# Altium schematic sheet 10X SD CARD READER SCH SHEET 3.SchDoc
size A2
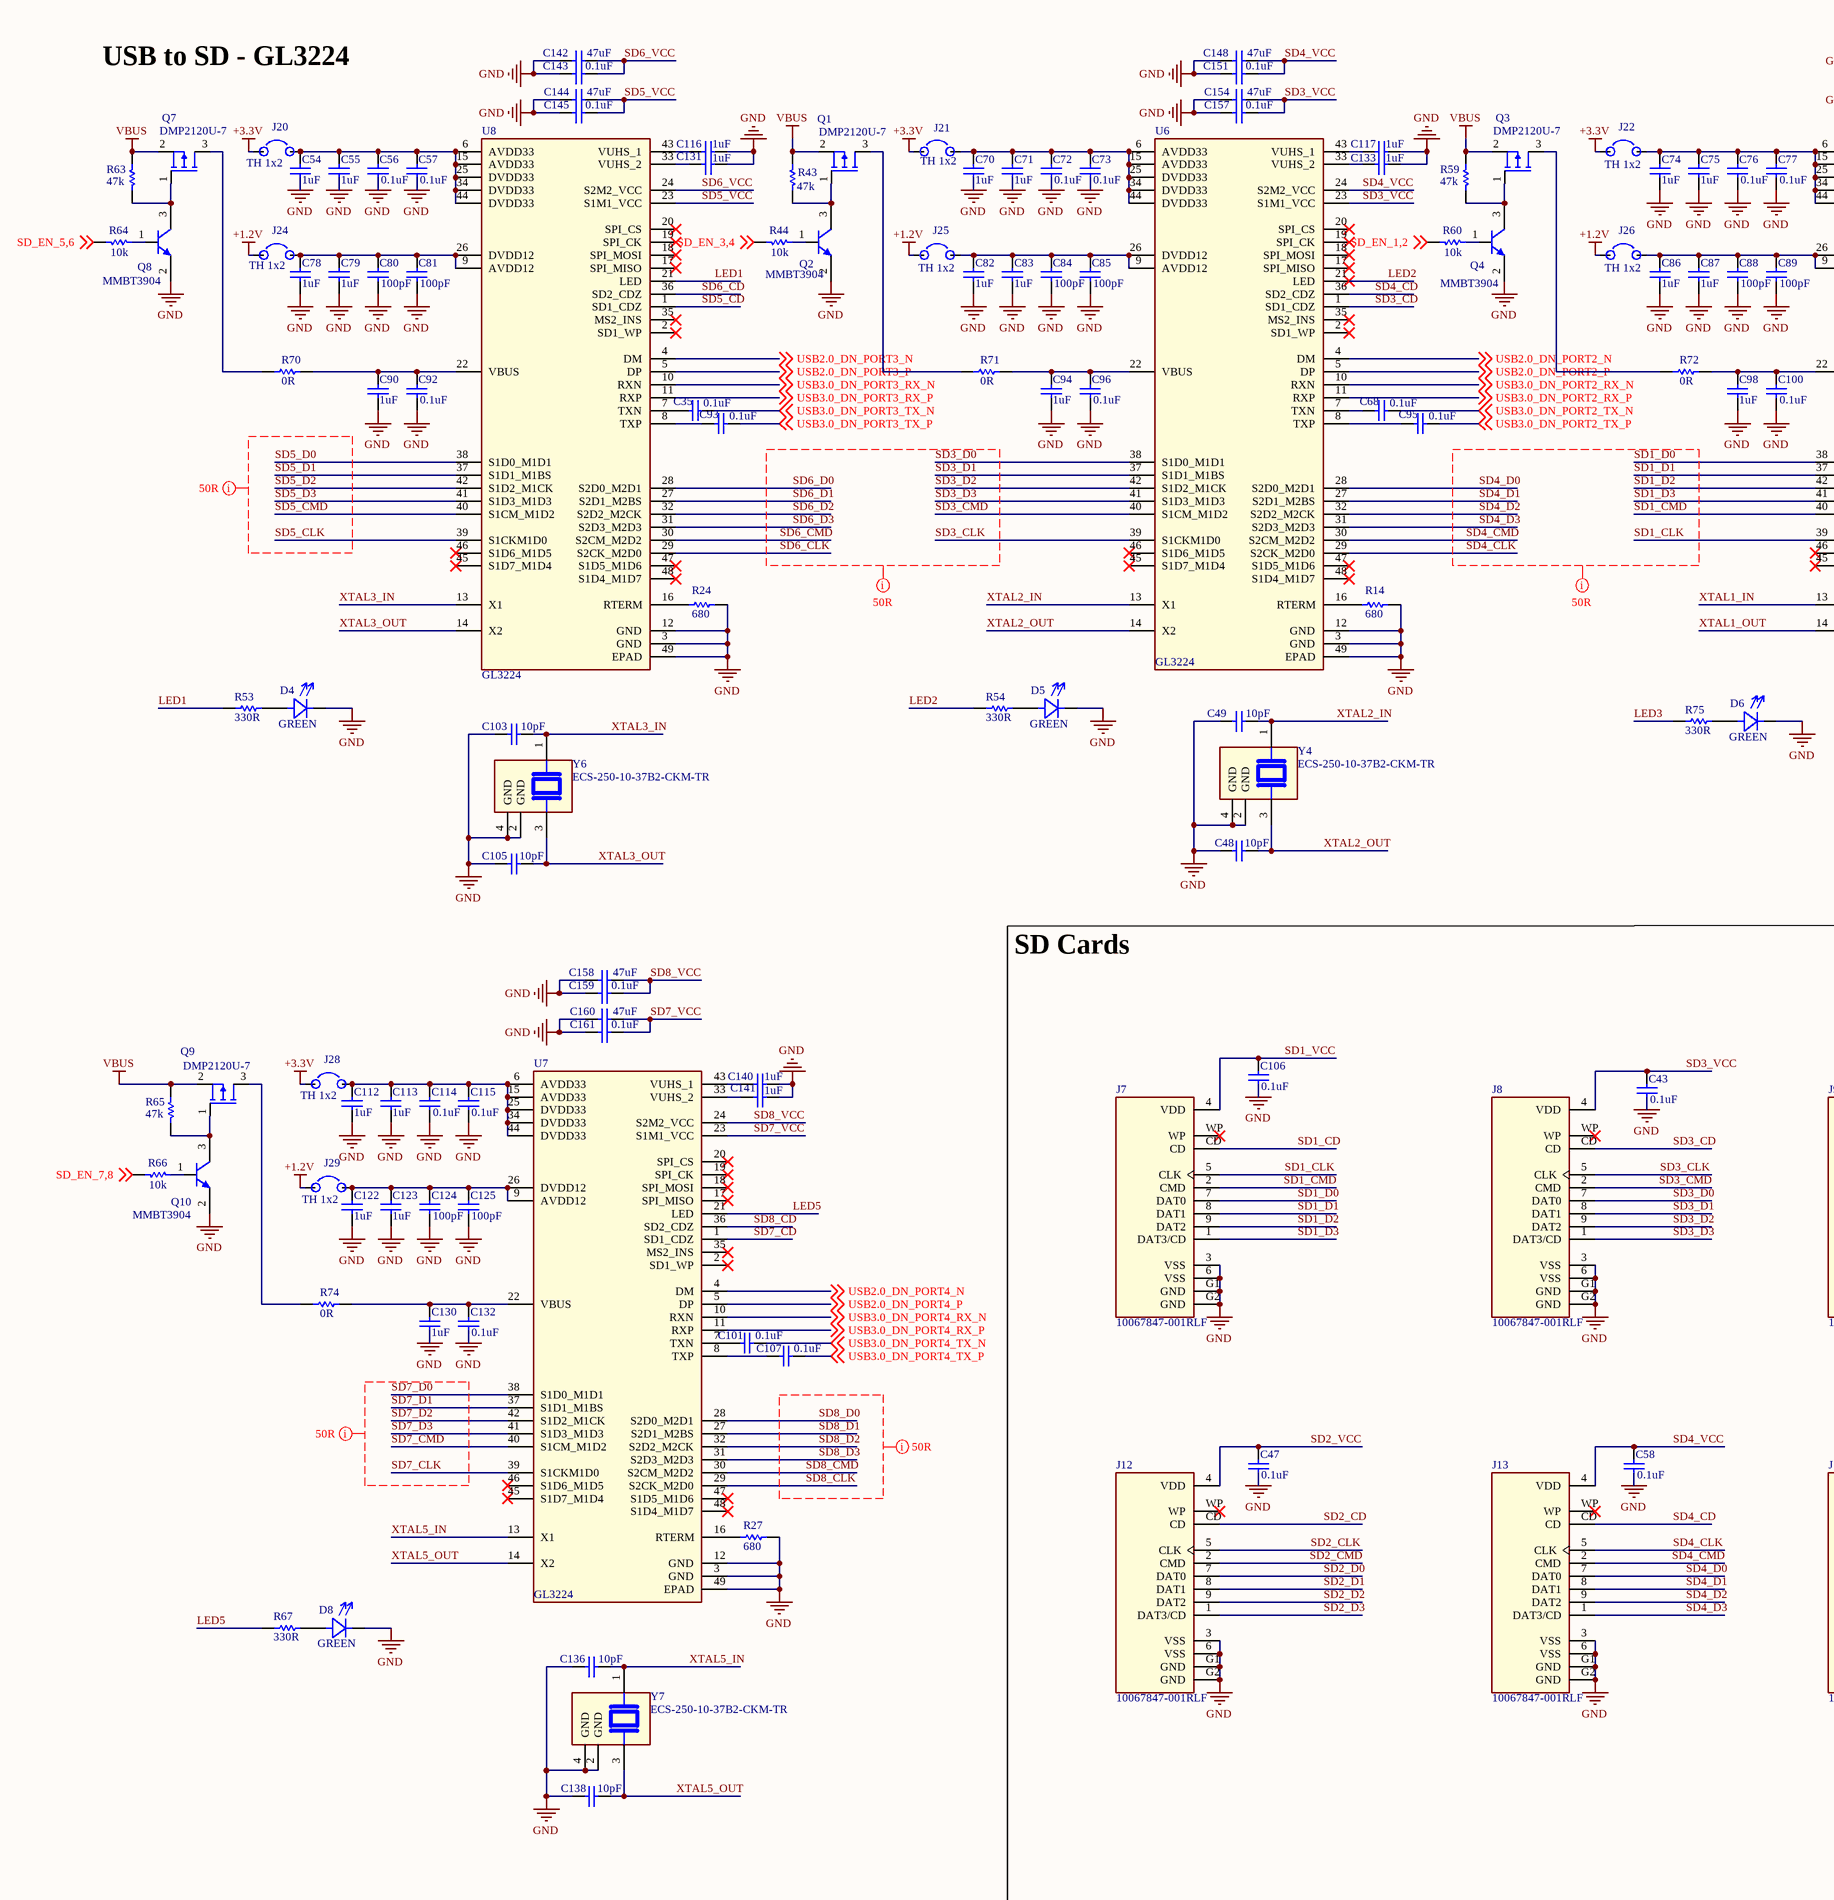
[diagram p0: 10X SD CARD READER SCH SHEET 3.SchDoc, left]
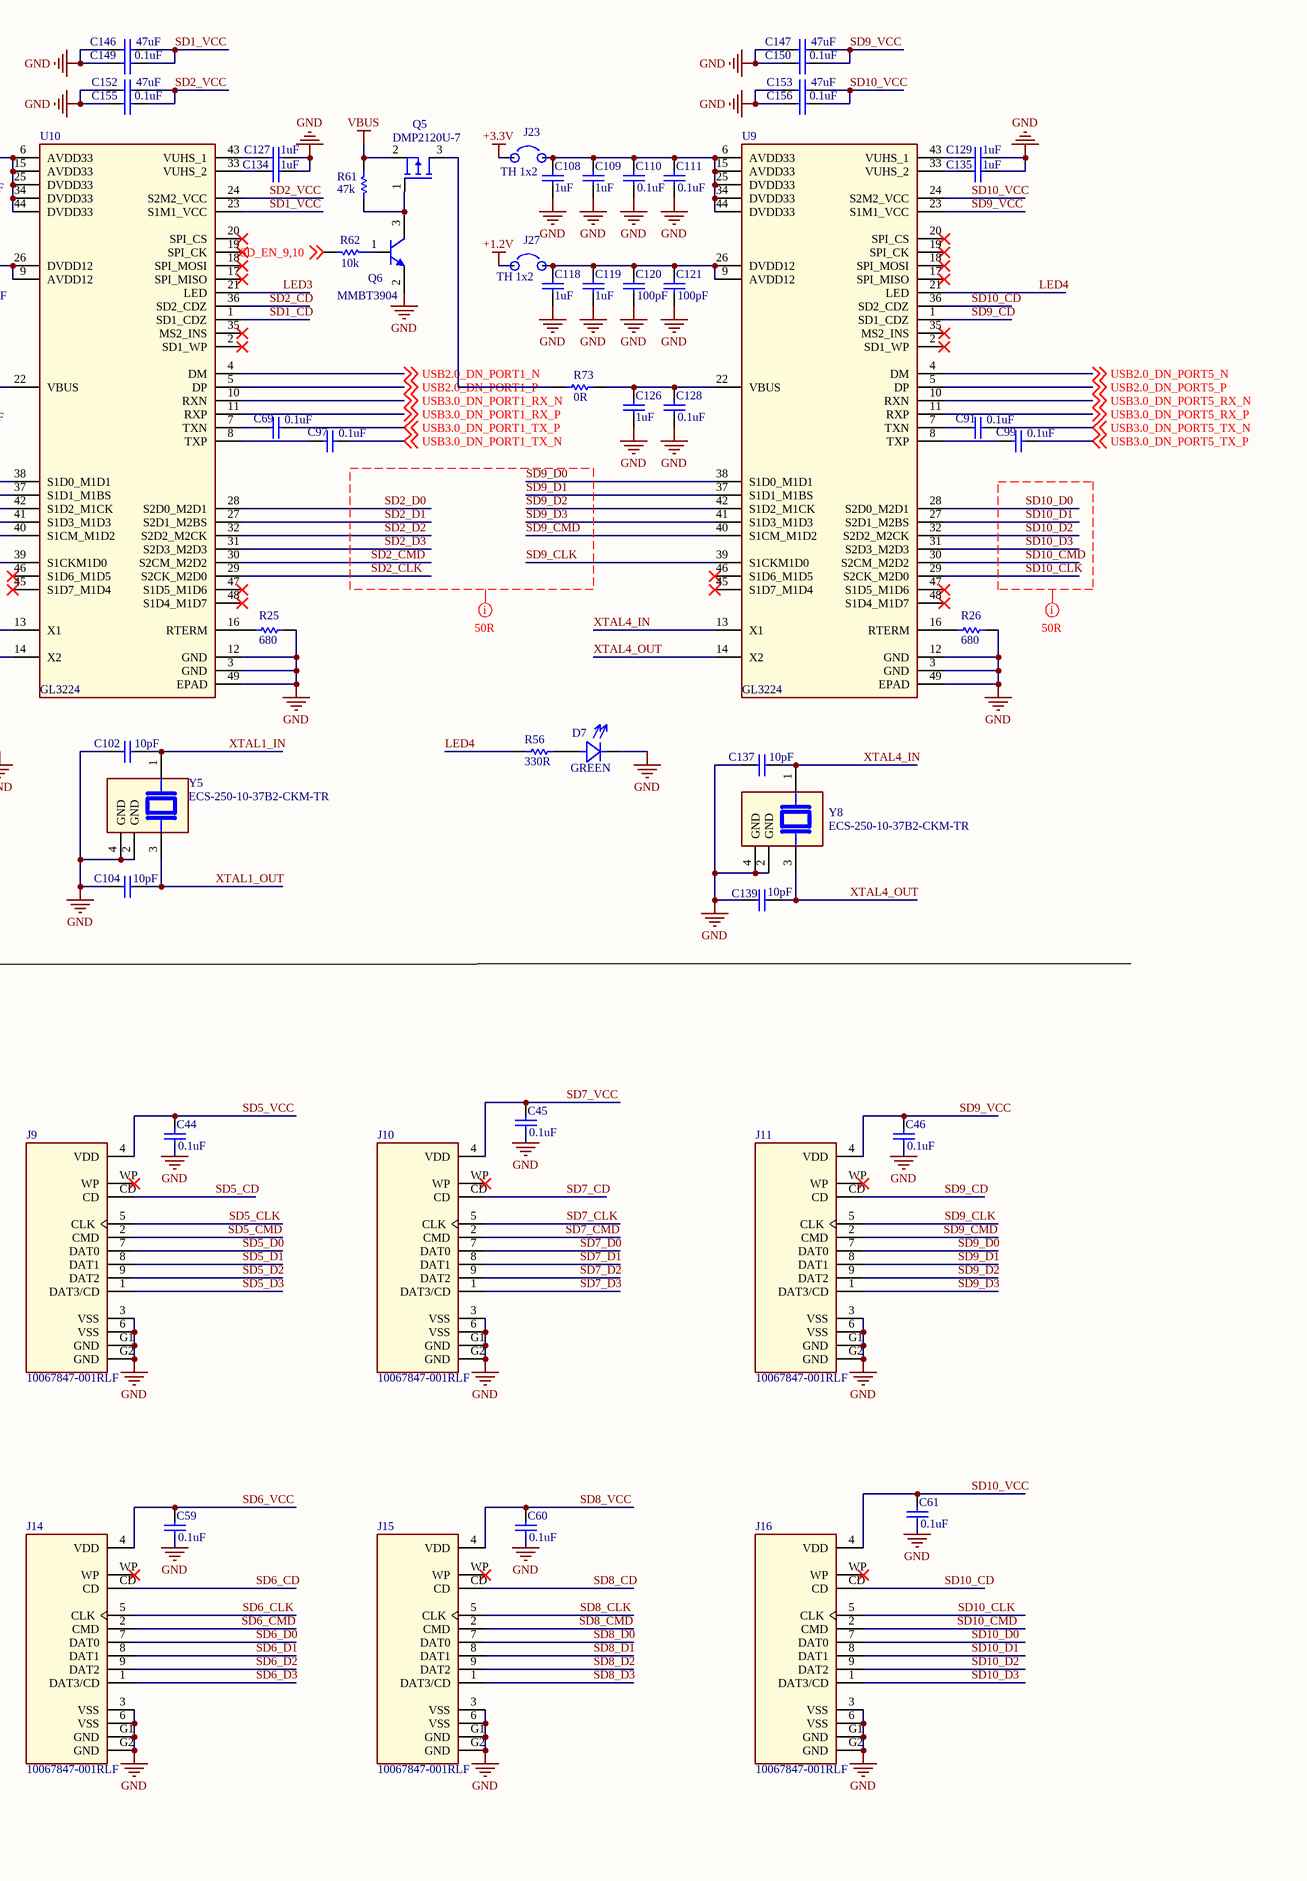
[diagram p1: 10X SD CARD READER SCH SHEET 3.SchDoc, right]

## Parts
C35  0.1uF  [C-0402/1005]
C43  0.1uF  [C-0402/1005]
C44  0.1uF  [C-0402/1005]
C45  0.1uF  [C-0402/1005]
C46  0.1uF  [C-0402/1005]
C47  0.1uF  [C-0402/1005]
C48  10pF  [C-0402/1005]
C49  10pF  [C-0402/1005]
C54  1uF  [C-0402/1005]
C55  1uF  [C-0402/1005]
C56  0.1uF  [C-0402/1005]
C57  0.1uF  [C-0402/1005]
C58  0.1uF  [C-0402/1005]
C59  0.1uF  [C-0402/1005]
C60  0.1uF  [C-0402/1005]
C61  0.1uF  [C-0402/1005]
C68  0.1uF  [C-0402/1005]
C69  0.1uF  [C-0402/1005]
C70  1uF  [C-0402/1005]
C71  1uF  [C-0402/1005]
C72  0.1uF  [C-0402/1005]
C73  0.1uF  [C-0402/1005]
C74  1uF  [C-0402/1005]
C75  1uF  [C-0402/1005]
C76  0.1uF  [C-0402/1005]
C77  0.1uF  [C-0402/1005]
C78  1uF  [C-0402/1005]
C79  1uF  [C-0402/1005]
C80  value 100pF  [C-0402/1005]  (hidden comment: 0.1uF)
C81  value 100pF  [C-0402/1005]  (hidden comment: 0.1uF)
C82  1uF  [C-0402/1005]
C83  1uF  [C-0402/1005]
C84  value 100pF  [C-0402/1005]  (hidden comment: 0.1uF)
C85  value 100pF  [C-0402/1005]  (hidden comment: 0.1uF)
C86  1uF  [C-0402/1005]
C87  1uF  [C-0402/1005]
C88  value 100pF  [C-0402/1005]  (hidden comment: 0.1uF)
C89  value 100pF  [C-0402/1005]  (hidden comment: 0.1uF)
C90  1uF  [C-0402/1005]
C91  0.1uF  [C-0402/1005]
C92  0.1uF  [C-0402/1005]
C93  0.1uF  [C-0402/1005]
C94  1uF  [C-0402/1005]
C95  0.1uF  [C-0402/1005]
C96  0.1uF  [C-0402/1005]
C97  0.1uF  [C-0402/1005]
C98  1uF  [C-0402/1005]
C99  0.1uF  [C-0402/1005]
C100  0.1uF  [C-0402/1005]
C101  0.1uF  [C-0402/1005]
C102  10pF  [C-0402/1005]
C103  10pF  [C-0402/1005]
C104  10pF  [C-0402/1005]
C105  10pF  [C-0402/1005]
C106  0.1uF  [C-0402/1005]
C107  0.1uF  [C-0402/1005]
C108  1uF  [C-0402/1005]
C109  1uF  [C-0402/1005]
C110  0.1uF  [C-0402/1005]
C111  0.1uF  [C-0402/1005]
C112  1uF  [C-0402/1005]
C113  1uF  [C-0402/1005]
C114  0.1uF  [C-0402/1005]
C115  0.1uF  [C-0402/1005]
C116  1uF  [C-0402/1005]
C117  1uF  [C-0402/1005]
C118  1uF  [C-0402/1005]
C119  1uF  [C-0402/1005]
C120  value 100pF  [C-0402/1005]  (hidden comment: 0.1uF)
C121  value 100pF  [C-0402/1005]  (hidden comment: 0.1uF)
C122  1uF  [C-0402/1005]
C123  1uF  [C-0402/1005]
C124  value 100pF  [C-0402/1005]  (hidden comment: 0.1uF)
C125  value 100pF  [C-0402/1005]  (hidden comment: 0.1uF)
C126  1uF  [C-0402/1005]
C127  1uF  [C-0402/1005]
C128  0.1uF  [C-0402/1005]
C129  1uF  [C-0402/1005]
C130  1uF  [C-0402/1005]
C131  1uF  [C-0402/1005]
C132  0.1uF  [C-0402/1005]
C133  1uF  [C-0402/1005]
C134  1uF  [C-0402/1005]
C135  1uF  [C-0402/1005]
C136  10pF  [C-0402/1005]
C137  10pF  [C-0402/1005]
C138  10pF  [C-0402/1005]
C139  10pF  [C-0402/1005]
C140  1uF  [C-0402/1005]
C141  1uF  [C-0402/1005]
C142  value 47uF  [C-0603/1608]  (hidden comment: 0.1uF)
C143  0.1uF  [C-0402/1005]
C144  value 47uF  [C-0603/1608]  (hidden comment: 0.1uF)
C145  0.1uF  [C-0402/1005]
C146  value 47uF  [C-0603/1608]  (hidden comment: 0.1uF)
C147  value 47uF  [C-0603/1608]  (hidden comment: 0.1uF)
C148  value 47uF  [C-0603/1608]  (hidden comment: 0.1uF)
C149  0.1uF  [C-0402/1005]
C150  0.1uF  [C-0402/1005]
C151  0.1uF  [C-0402/1005]
C152  value 47uF  [C-0603/1608]  (hidden comment: 0.1uF)
C153  value 47uF  [C-0603/1608]  (hidden comment: 0.1uF)
C154  value 47uF  [C-0603/1608]  (hidden comment: 0.1uF)
C155  0.1uF  [C-0402/1005]
C156  0.1uF  [C-0402/1005]
C157  0.1uF  [C-0402/1005]
C158  value 47uF  [C-0603/1608]  (hidden comment: 0.1uF)
C159  0.1uF  [C-0402/1005]
C160  value 47uF  [C-0603/1608]  (hidden comment: 0.1uF)
C161  0.1uF  [C-0402/1005]
D4  GREEN  [LEDC1608X65N]
D5  GREEN  [LEDC1608X65N]
D6  GREEN  [LEDC1608X65N]
D7  GREEN  [LEDC1608X65N]
D8  GREEN  [LEDC1608X65N]
J7  10067847-001RLF  [AMPHENOL_10067847-011RLF]
J8  10067847-001RLF  [AMPHENOL_10067847-011RLF]
J9  10067847-001RLF  [AMPHENOL_10067847-011RLF]
J10  10067847-001RLF  [AMPHENOL_10067847-011RLF]
J11  10067847-001RLF  [AMPHENOL_10067847-011RLF]
J12  10067847-001RLF  [AMPHENOL_10067847-011RLF]
J13  10067847-001RLF  [AMPHENOL_10067847-011RLF]
J14  10067847-001RLF  [AMPHENOL_10067847-011RLF]
J15  10067847-001RLF  [AMPHENOL_10067847-011RLF]
J16  10067847-001RLF  [AMPHENOL_10067847-011RLF]
J20  TH 1x2  [PIN HEADER 1x2 2.54mm]
J21  TH 1x2  [PIN HEADER 1x2 2.54mm]
J22  TH 1x2  [PIN HEADER 1x2 2.54mm]
J23  TH 1x2  [PIN HEADER 1x2 2.54mm]
J24  TH 1x2  [PIN HEADER 1x2 2.54mm]
J25  TH 1x2  [PIN HEADER 1x2 2.54mm]
J26  TH 1x2  [PIN HEADER 1x2 2.54mm]
J27  TH 1x2  [PIN HEADER 1x2 2.54mm]
J28  TH 1x2  [PIN HEADER 1x2 2.54mm]
J29  TH 1x2  [PIN HEADER 1x2 2.54mm]
Q1  DMP2120U-7  [SOT-23-3]
Q2  MMBT3904  [SOT-23-3]
Q3  DMP2120U-7  [SOT-23-3]
Q4  MMBT3904  [SOT-23-3]
Q5  DMP2120U-7  [SOT-23-3]
Q6  MMBT3904  [SOT-23-3]
Q7  DMP2120U-7  [SOT-23-3]
Q8  MMBT3904  [SOT-23-3]
Q9  DMP2120U-7  [SOT-23-3]
Q10  MMBT3904  [SOT-23-3]
R14  680  [R-0402/1005]
R24  680  [R-0402/1005]
R25  680  [R-0402/1005]
R26  680  [R-0402/1005]
R27  680  [R-0402/1005]
R43  47k  [R-0402/1005]
R44  10k  [R-0402/1005]
R53  330R  [R-0402/1005]
R54  330R  [R-0402/1005]
R56  330R  [R-0402/1005]
R59  47k  [R-0402/1005]
R60  10k  [R-0402/1005]
R61  47k  [R-0402/1005]
R62  10k  [R-0402/1005]
R63  47k  [R-0402/1005]
R64  10k  [R-0402/1005]
R65  47k  [R-0402/1005]
R66  10k  [R-0402/1005]
R67  330R  [R-0402/1005]
R70  0R  [R-0603/1608]
R71  0R  [R-0603/1608]
R72  0R  [R-0603/1608]
R73  0R  [R-0603/1608]
R74  0R  [R-0603/1608]
R75  330R  [R-0402/1005]
U6  GL3224  [GL3224]
U7  GL3224  [GL3224]
U8  GL3224  [GL3224]
U9  GL3224  [GL3224]
U10  GL3224  [GL3224]
Y4  ECS-250-10-37B2-CKM-TR  [ECS-250-10-37B2]
Y5  ECS-250-10-37B2-CKM-TR  [ECS-250-10-37B2]
Y6  ECS-250-10-37B2-CKM-TR  [ECS-250-10-37B2]
Y7  ECS-250-10-37B2-CKM-TR  [ECS-250-10-37B2]
Y8  ECS-250-10-37B2-CKM-TR  [ECS-250-10-37B2]

## Nets
+1.2V: J24.1 J25.1 J26.1 J27.1 J29.1
+3.3V: J20.1 J21.1 J22.1 J23.1 J28.1
GND: C43.1 C44.1 C45.1 C46.1 C47.1 C48.2 C49.2 C54.1 C55.1 C56.1 C57.1 C58.1 C59.1 C60.1 C61.1 C70.1 C71.1 C72.1 C73.1 C74.1 C75.1 C76.1 C77.1 C78.1 C79.1 C80.1 C81.1 C82.1 C83.1 C84.1 C85.1 C86.1 C87.1 C88.1 C89.1 C90.1 C92.1 C94.1 C96.1 C98.1 C100.1 C102.2 C103.2 C104.2 C105.2 C106.1 C108.1 C109.1 C110.1 C111.1 C112.1 C113.1 C114.1 C115.1 C116.1 C117.1 C118.1 C119.1 C120.1 C121.1 C122.1 C123.1 C124.1 C125.1 C126.1 C127.1 C128.1 C129.1 C130.1 C131.1 C132.1 C133.1 C134.1 C135.1 C136.2 C137.2 C138.2 C139.2 C140.1 C141.1 C142.1 C143.1 C144.1 C145.1 C146.1 C147.1 C148.1 C149.1 C150.1 C151.1 C152.1 C153.1 C154.1 C155.1 C156.1 C157.1 C158.1 C159.1 C160.1 C161.1 D4.C D5.C D6.C D7.C D8.C J7.3(VSS) J7.6(VSS) J7.G1(GND) J7.G2(GND) J8.3(VSS) J8.6(VSS) J8.G1(GND) J8.G2(GND) J9.3(VSS) J9.6(VSS) J9.G1(GND) J9.G2(GND) J10.3(VSS) J10.6(VSS) J10.G1(GND) J10.G2(GND) J11.3(VSS) J11.6(VSS) J11.G1(GND) J11.G2(GND) J12.3(VSS) J12.6(VSS) J12.G1(GND) J12.G2(GND) J13.3(VSS) J13.6(VSS) J13.G1(GND) J13.G2(GND) J14.3(VSS) J14.6(VSS) J14.G1(GND) J14.G2(GND) J15.3(VSS) J15.6(VSS) J15.G1(GND) J15.G2(GND) J16.3(VSS) J16.6(VSS) J16.G1(GND) J16.G2(GND) Q2.2(E) Q4.2(E) Q6.2(E) Q8.2(E) Q10.2(E) R14.1 R24.1 R25.1 R26.1 R27.1 U6.3(GND) U6.12(GND) U6.49(EPAD) U7.3(GND) U7.12(GND) U7.49(EPAD) U8.3(GND) U8.12(GND) U8.49(EPAD) U9.3(GND) U9.12(GND) U9.49(EPAD) U10.3(GND) U10.12(GND) U10.49(EPAD) Y4.2(GND) Y4.4(GND) Y5.2(GND) Y5.4(GND) Y6.2(GND) Y6.4(GND) Y7.2(GND) Y7.4(GND) Y8.2(GND) Y8.4(GND)
VBUS: Q1.2 Q3.2 Q5.2 Q7.2 Q9.2 R43.1 R59.1 R61.1 R63.1 R65.1
LED1: R53.2 U8.21(LED)
LED2: R54.2 U6.21(LED)
LED3: R75.2 U10.21(LED)
LED4: R56.2 U9.21(LED)
LED5: R67.2 U7.21(LED)
SD1_CD: J7.CD U10.1(SD1_CDZ)
SD1_CLK: J7.5(CLK) U10.39(S1CKM1D0)
SD1_CMD: J7.2(CMD) U10.40(S1CM_M1D2)
SD1_D0: J7.7(DAT0) U10.38(S1D0_M1D1)
SD1_D1: J7.8(DAT1) U10.37(S1D1_M1BS)
SD1_D2: J7.9(DAT2) U10.42(S1D2_M1CK)
SD1_D3: J7.1(DAT3/CD) U10.41(S1D3_M1D3)
SD1_VCC: C106.2 C146.2 C149.2 J7.4(VDD) U10.23(S1M1_VCC)
SD2_CD: J12.CD U10.36(SD2_CDZ)
SD2_CLK: J12.5(CLK) U10.29(S2CK_M2D0)
SD2_CMD: J12.2(CMD) U10.30(S2CM_M2D2)
SD2_D0: J12.7(DAT0) U10.28(S2D0_M2D1)
SD2_D1: J12.8(DAT1) U10.27(S2D1_M2BS)
SD2_D2: J12.9(DAT2) U10.32(S2D2_M2CK)
SD2_D3: J12.1(DAT3/CD) U10.31(S2D3_M2D3)
SD2_VCC: C47.2 C152.2 C155.2 J12.4(VDD) U10.24(S2M2_VCC)
SD3_CD: J8.CD U6.1(SD1_CDZ)
SD3_CLK: J8.5(CLK) U6.39(S1CKM1D0)
SD3_CMD: J8.2(CMD) U6.40(S1CM_M1D2)
SD3_D0: J8.7(DAT0) U6.38(S1D0_M1D1)
SD3_D1: J8.8(DAT1) U6.37(S1D1_M1BS)
SD3_D2: J8.9(DAT2) U6.42(S1D2_M1CK)
SD3_D3: J8.1(DAT3/CD) U6.41(S1D3_M1D3)
SD3_VCC: C43.2 C154.2 C157.2 J8.4(VDD) U6.23(S1M1_VCC)
SD4_CD: J13.CD U6.36(SD2_CDZ)
SD4_CLK: J13.5(CLK) U6.29(S2CK_M2D0)
SD4_CMD: J13.2(CMD) U6.30(S2CM_M2D2)
SD4_D0: J13.7(DAT0) U6.28(S2D0_M2D1)
SD4_D1: J13.8(DAT1) U6.27(S2D1_M2BS)
SD4_D2: J13.9(DAT2) U6.32(S2D2_M2CK)
SD4_D3: J13.1(DAT3/CD) U6.31(S2D3_M2D3)
SD4_VCC: C58.2 C148.2 C151.2 J13.4(VDD) U6.24(S2M2_VCC)
SD5_CD: J9.CD U8.1(SD1_CDZ)
SD5_CLK: J9.5(CLK) U8.39(S1CKM1D0)
SD5_CMD: J9.2(CMD) U8.40(S1CM_M1D2)
SD5_D0: J9.7(DAT0) U8.38(S1D0_M1D1)
SD5_D1: J9.8(DAT1) U8.37(S1D1_M1BS)
SD5_D2: J9.9(DAT2) U8.42(S1D2_M1CK)
SD5_D3: J9.1(DAT3/CD) U8.41(S1D3_M1D3)
SD5_VCC: C44.2 C144.2 C145.2 J9.4(VDD) U8.23(S1M1_VCC)
SD6_CD: J14.CD U8.36(SD2_CDZ)
SD6_CLK: J14.5(CLK) U8.29(S2CK_M2D0)
SD6_CMD: J14.2(CMD) U8.30(S2CM_M2D2)
SD6_D0: J14.7(DAT0) U8.28(S2D0_M2D1)
SD6_D1: J14.8(DAT1) U8.27(S2D1_M2BS)
SD6_D2: J14.9(DAT2) U8.32(S2D2_M2CK)
SD6_D3: J14.1(DAT3/CD) U8.31(S2D3_M2D3)
SD6_VCC: C59.2 C142.2 C143.2 J14.4(VDD) U8.24(S2M2_VCC)
SD7_CD: J10.CD U7.1(SD1_CDZ)
SD7_CLK: J10.5(CLK) U7.39(S1CKM1D0)
SD7_CMD: J10.2(CMD) U7.40(S1CM_M1D2)
SD7_D0: J10.7(DAT0) U7.38(S1D0_M1D1)
SD7_D1: J10.8(DAT1) U7.37(S1D1_M1BS)
SD7_D2: J10.9(DAT2) U7.42(S1D2_M1CK)
SD7_D3: J10.1(DAT3/CD) U7.41(S1D3_M1D3)
SD7_VCC: C45.2 C160.2 C161.2 J10.4(VDD) U7.23(S1M1_VCC)
SD8_CD: J15.CD U7.36(SD2_CDZ)
SD8_CLK: J15.5(CLK) U7.29(S2CK_M2D0)
SD8_CMD: J15.2(CMD) U7.30(S2CM_M2D2)
SD8_D0: J15.7(DAT0) U7.28(S2D0_M2D1)
SD8_D1: J15.8(DAT1) U7.27(S2D1_M2BS)
SD8_D2: J15.9(DAT2) U7.32(S2D2_M2CK)
SD8_D3: J15.1(DAT3/CD) U7.31(S2D3_M2D3)
SD8_VCC: C60.2 C158.2 C159.2 J15.4(VDD) U7.24(S2M2_VCC)
SD9_CD: J11.CD U9.1(SD1_CDZ)
SD9_CLK: J11.5(CLK) U9.39(S1CKM1D0)
SD9_CMD: J11.2(CMD) U9.40(S1CM_M1D2)
SD9_D0: J11.7(DAT0) U9.38(S1D0_M1D1)
SD9_D1: J11.8(DAT1) U9.37(S1D1_M1BS)
SD9_D2: J11.9(DAT2) U9.42(S1D2_M1CK)
SD9_D3: J11.1(DAT3/CD) U9.41(S1D3_M1D3)
SD9_VCC: C46.2 C147.2 C150.2 J11.4(VDD) U9.23(S1M1_VCC)
SD10_CD: J16.CD U9.36(SD2_CDZ)
SD10_CLK: J16.5(CLK) U9.29(S2CK_M2D0)
SD10_CMD: J16.2(CMD) U9.30(S2CM_M2D2)
SD10_D0: J16.7(DAT0) U9.28(S2D0_M2D1)
SD10_D1: J16.8(DAT1) U9.27(S2D1_M2BS)
SD10_D2: J16.9(DAT2) U9.32(S2D2_M2CK)
SD10_D3: J16.1(DAT3/CD) U9.31(S2D3_M2D3)
SD10_VCC: C61.2 C153.2 C156.2 J16.4(VDD) U9.24(S2M2_VCC)
SD_EN_1,2: R60.1 ; off-sheet SD_EN_1,2
SD_EN_3,4: R44.1 ; off-sheet SD_EN_3,4
SD_EN_5,6: R64.1 ; off-sheet SD_EN_5,6
SD_EN_7,8: R66.1 ; off-sheet SD_EN_7,8
SD_EN_9,10: R62.1 ; off-sheet SD_EN_9,10
USB2.0_DN_PORT1_N: U10.4(DM) ; off-sheet USB2.0_DN_PORT1_N
USB2.0_DN_PORT1_P: U10.5(DP) ; off-sheet USB2.0_DN_PORT1_P
USB2.0_DN_PORT2_N: U6.4(DM) ; off-sheet USB2.0_DN_PORT2_N
USB2.0_DN_PORT2_P: U6.5(DP) ; off-sheet USB2.0_DN_PORT2_P
USB2.0_DN_PORT3_N: U8.4(DM) ; off-sheet USB2.0_DN_PORT3_N
USB2.0_DN_PORT3_P: U8.5(DP) ; off-sheet USB2.0_DN_PORT3_P
USB2.0_DN_PORT4_N: U7.4(DM) ; off-sheet USB2.0_DN_PORT4_N
USB2.0_DN_PORT4_P: U7.5(DP) ; off-sheet USB2.0_DN_PORT4_P
USB2.0_DN_PORT5_N: U9.4(DM) ; off-sheet USB2.0_DN_PORT5_N
USB2.0_DN_PORT5_P: U9.5(DP) ; off-sheet USB2.0_DN_PORT5_P
USB3.0_DN_PORT1_RX_N: U10.10(RXN) ; off-sheet USB3.0_DN_PORT1_RX_N
USB3.0_DN_PORT1_RX_P: U10.11(RXP) ; off-sheet USB3.0_DN_PORT1_RX_P
USB3.0_DN_PORT1_TX_N: C97.1 ; off-sheet USB3.0_DN_PORT1_TX_N
USB3.0_DN_PORT1_TX_P: C69.1 ; off-sheet USB3.0_DN_PORT1_TX_P
USB3.0_DN_PORT2_RX_N: U6.10(RXN) ; off-sheet USB3.0_DN_PORT2_RX_N
USB3.0_DN_PORT2_RX_P: U6.11(RXP) ; off-sheet USB3.0_DN_PORT2_RX_P
USB3.0_DN_PORT2_TX_N: C68.1 ; off-sheet USB3.0_DN_PORT2_TX_N
USB3.0_DN_PORT2_TX_P: C95.1 ; off-sheet USB3.0_DN_PORT2_TX_P
USB3.0_DN_PORT3_RX_N: U8.10(RXN) ; off-sheet USB3.0_DN_PORT3_RX_N
USB3.0_DN_PORT3_RX_P: U8.11(RXP) ; off-sheet USB3.0_DN_PORT3_RX_P
USB3.0_DN_PORT3_TX_N: C35.1 ; off-sheet USB3.0_DN_PORT3_TX_N
USB3.0_DN_PORT3_TX_P: C93.1 ; off-sheet USB3.0_DN_PORT3_TX_P
USB3.0_DN_PORT4_RX_N: U7.10(RXN) ; off-sheet USB3.0_DN_PORT4_RX_N
USB3.0_DN_PORT4_RX_P: U7.11(RXP) ; off-sheet USB3.0_DN_PORT4_RX_P
USB3.0_DN_PORT4_TX_N: C101.1 ; off-sheet USB3.0_DN_PORT4_TX_N
USB3.0_DN_PORT4_TX_P: C107.1 ; off-sheet USB3.0_DN_PORT4_TX_P
USB3.0_DN_PORT5_RX_N: U9.10(RXN) ; off-sheet USB3.0_DN_PORT5_RX_N
USB3.0_DN_PORT5_RX_P: U9.11(RXP) ; off-sheet USB3.0_DN_PORT5_RX_P
USB3.0_DN_PORT5_TX_N: C91.1 ; off-sheet USB3.0_DN_PORT5_TX_N
USB3.0_DN_PORT5_TX_P: C99.1 ; off-sheet USB3.0_DN_PORT5_TX_P
XTAL1_IN: C102.1 U10.13(X1) Y5.1
XTAL1_OUT: C104.1 U10.14(X2) Y5.3
XTAL2_IN: C49.1 U6.13(X1) Y4.1
XTAL2_OUT: C48.1 U6.14(X2) Y4.3
XTAL3_IN: C103.1 U8.13(X1) Y6.1
XTAL3_OUT: C105.1 U8.14(X2) Y6.3
XTAL4_IN: C137.1 U9.13(X1) Y8.1
XTAL4_OUT: C139.1 U9.14(X2) Y8.3
XTAL5_IN: C136.1 U7.13(X1) Y7.1
XTAL5_OUT: C138.1 U7.14(X2) Y7.3
NetC35_2: C35.2 U8.7(TXN)
NetC54_2: C54.2 C55.2 C56.2 C57.2 J20.2 U8.6(AVDD33) U8.15(AVDD33) U8.25(DVDD33) U8.34(DVDD33) U8.44(DVDD33)
NetC68_2: C68.2 U6.7(TXN)
NetC69_2: C69.2 U10.7(TXN)
NetC70_2: C70.2 C71.2 C72.2 C73.2 J21.2 U6.6(AVDD33) U6.15(AVDD33) U6.25(DVDD33) U6.34(DVDD33) U6.44(DVDD33)
NetC74_2: C74.2 C75.2 C76.2 C77.2 J22.2 U10.6(AVDD33) U10.15(AVDD33) U10.25(DVDD33) U10.34(DVDD33) U10.44(DVDD33)
NetC78_2: C78.2 C79.2 C80.2 C81.2 J24.2 U8.9(AVDD12) U8.26(DVDD12)
NetC82_2: C82.2 C83.2 C84.2 C85.2 J25.2 U6.9(AVDD12) U6.26(DVDD12)
NetC86_2: C86.2 C87.2 C88.2 C89.2 J26.2 U10.9(AVDD12) U10.26(DVDD12)
NetC90_2: C90.2 C92.2 R70.2 U8.22(VBUS)
NetC91_2: C91.2 U9.7(TXN)
NetC93_2: C93.2 U8.8(TXP)
NetC94_2: C94.2 C96.2 R71.2 U6.22(VBUS)
NetC95_2: C95.2 U6.8(TXP)
NetC97_2: C97.2 U10.8(TXP)
NetC98_2: C98.2 C100.2 R72.2 U10.22(VBUS)
NetC99_2: C99.2 U9.8(TXP)
NetC101_2: C101.2 U7.7(TXN)
NetC107_2: C107.2 U7.8(TXP)
NetC108_2: C108.2 C109.2 C110.2 C111.2 J23.2 U9.6(AVDD33) U9.15(AVDD33) U9.25(DVDD33) U9.34(DVDD33) U9.44(DVDD33)
NetC112_2: C112.2 C113.2 C114.2 C115.2 J28.2 U7.6(AVDD33) U7.15(AVDD33) U7.25(DVDD33) U7.34(DVDD33) U7.44(DVDD33)
NetC116_2: C116.2 U8.43(VUHS_1)
NetC117_2: C117.2 U6.43(VUHS_1)
NetC118_2: C118.2 C119.2 C120.2 C121.2 J27.2 U9.9(AVDD12) U9.26(DVDD12)
NetC122_2: C122.2 C123.2 C124.2 C125.2 J29.2 U7.9(AVDD12) U7.26(DVDD12)
NetC126_2: C126.2 C128.2 R73.2 U9.22(VBUS)
NetC127_2: C127.2 U10.43(VUHS_1)
NetC129_2: C129.2 U9.43(VUHS_1)
NetC130_2: C130.2 C132.2 R74.2 U7.22(VBUS)
NetC131_2: C131.2 U8.33(VUHS_2)
NetC133_2: C133.2 U6.33(VUHS_2)
NetC134_2: C134.2 U10.33(VUHS_2)
NetC135_2: C135.2 U9.33(VUHS_2)
NetC140_2: C140.2 U7.43(VUHS_1)
NetC141_2: C141.2 U7.33(VUHS_2)
NetD4_A: D4.A R53.1
NetD5_A: D5.A R54.1
NetD6_A: D6.A R75.1
NetD7_A: D7.A R56.1
NetD8_A: D8.A R67.1
NetQ1_1: Q1.1 Q2.3(C) R43.2
NetQ1_3: Q1.3 R71.1
NetQ2_1: Q2.1(B) R44.2
NetQ3_1: Q3.1 Q4.3(C) R59.2
NetQ3_3: Q3.3 R72.1
NetQ4_1: Q4.1(B) R60.2
NetQ5_1: Q5.1 Q6.3(C) R61.2
NetQ5_3: Q5.3 R73.1
NetQ6_1: Q6.1(B) R62.2
NetQ7_1: Q7.1 Q8.3(C) R63.2
NetQ7_3: Q7.3 R70.1
NetQ8_1: Q8.1(B) R64.2
NetQ9_1: Q9.1 Q10.3(C) R65.2
NetQ9_3: Q9.3 R74.1
NetQ10_1: Q10.1(B) R66.2
NetR14_2: R14.2 U6.16(RTERM)
NetR24_2: R24.2 U8.16(RTERM)
NetR25_2: R25.2 U10.16(RTERM)
NetR26_2: R26.2 U9.16(RTERM)
NetR27_2: R27.2 U7.16(RTERM)

Not connected (* = marked no-connect by the designer): J7 WP*; J8 WP*; J9 WP*; J10 WP*; J11 WP*; J12 WP*; J13 WP*; J14 WP*; J15 WP*; J16 WP*; U6 2(SD1_WP)* 17(SPI_MISO)* 18(SPI_MOSI)* 19(SPI_CK)* 20(SPI_CS)* 35(MS2_INS)* 45(S1D7_M1D4)* 46(S1D6_M1D5)* 47(S1D5_M1D6)* 48(S1D4_M1D7)*; U7 2(SD1_WP)* 17(SPI_MISO)* 18(SPI_MOSI)* 19(SPI_CK)* 20(SPI_CS)* 35(MS2_INS)* 45(S1D7_M1D4)* 46(S1D6_M1D5)* 47(S1D5_M1D6)* 48(S1D4_M1D7)*; U8 2(SD1_WP)* 17(SPI_MISO)* 18(SPI_MOSI)* 19(SPI_CK)* 20(SPI_CS)* 35(MS2_INS)* 45(S1D7_M1D4)* 46(S1D6_M1D5)* 47(S1D5_M1D6)* 48(S1D4_M1D7)*; U9 2(SD1_WP)* 17(SPI_MISO)* 18(SPI_MOSI)* 19(SPI_CK)* 20(SPI_CS)* 35(MS2_INS)* 45(S1D7_M1D4)* 46(S1D6_M1D5)* 47(S1D5_M1D6)* 48(S1D4_M1D7)*; U10 2(SD1_WP)* 17(SPI_MISO)* 18(SPI_MOSI)* 19(SPI_CK)* 20(SPI_CS)* 35(MS2_INS)* 45(S1D7_M1D4)* 46(S1D6_M1D5)* 47(S1D5_M1D6)* 48(S1D4_M1D7)*

## Layout directives
net class 50R: SD1_CLK, SD1_CMD, SD1_D0, SD1_D1, SD1_D2, SD1_D3, SD2_CLK, SD2_CMD, SD2_D0, SD2_D1, SD2_D2, SD2_D3, SD3_CLK, SD3_CMD, SD3_D0, SD3_D1, SD3_D2, SD3_D3, SD4_CLK, SD4_CMD, SD4_D0, SD4_D1, SD4_D2, SD4_D3, SD5_CLK, SD5_CMD, SD5_D0, SD5_D1, SD5_D2, SD5_D3, SD6_CLK, SD6_CMD, SD6_D0, SD6_D1, SD6_D2, SD6_D3, SD7_CLK, SD7_CMD, SD7_D0, SD7_D1, SD7_D2, SD7_D3, SD8_CLK, SD8_CMD, SD8_D0, SD8_D1, SD8_D2, SD8_D3, SD9_CLK, SD9_CMD, SD9_D0, SD9_D1, SD9_D2, SD9_D3, SD10_CLK, SD10_CMD, SD10_D0, SD10_D1, SD10_D2, SD10_D3

## Notes on the sheet
- USB to SD - GL3224
- SD Cards
- Labels drawn without touching a wire or pin: \

## Library data of the parts
C35 C43-C47 C56-C61 C68 C69 C72 C73 C76 C77 C80 C81 C84 C85 C88 C89 C91-C93 C95-C97 C99-C101 C106 C107 C110 C111 C114 C115 C120 C121 C124 C125 C128 C132 C142-C161 = Cap: Capacitor; Published: 8-Jun-2000; LatestRevisionDate: 17-Jul-2002; LatestRevisionNote: Re-released for DXP Platform.; PackageReference: RAD-0.3; Publisher: Altium Limited; PackageDescription: Radial Cap, Thru-Hole; 2 Leads; 0.3 in Pin Spacing
  C35 C43-C47 C56-C61 C68 C69 C72 C73 C76 C77 C91-C93 C95-C97 C99-C101 C106 C107 C110 C111 C114 C115 C128 C132 C143 C145 C149-C151 C155-C157 C159 C161: Value: 0.1uF
C48 C49 C54 C55 C70 C71 C74 C75 C90 C94 C98 C102-C105 C108 C109 C112 C113 C126 C130 C136-C139 = Cap: Capacitor; Value: 0.1uF; Published: 8-Jun-2000; LatestRevisionDate: 17-Jul-2002; LatestRevisionNote: Re-released for DXP Platform.; PackageReference: RAD-0.3; Publisher: Altium Limited; PackageDescription: Radial Cap, Thru-Hole; 2 Leads; 0.3 in Pin Spacing
C78 C79 C82 C83 C86 C87 C116-C119 C122 C123 C127 C129 C131 C133-C135 C140 C141 = Cap: Capacitor; Value: 100pF; Published: 8-Jun-2000; LatestRevisionDate: 17-Jul-2002; LatestRevisionNote: Re-released for DXP Platform.; PackageReference: RAD-0.3; Publisher: Altium Limited; PackageDescription: Radial Cap, Thru-Hole; 2 Leads; 0.3 in Pin Spacing
D4-D8 = Diode-LED: Supplier: Digikey Electronics
J7-J16 = 10067847-001RLF: 12 (9 + 3) Position Card Connector Secure Digital - SD Surface Mount Gold; MF: Amphenol ICC; MP: 10067847-001RLF; Digi-Key_Part_Number: 609-3956-1-ND; Check_prices: https://www.snapeda.com/parts/10067847-001RLF/Amphenol%20FCI/view-part/1746378/?ref=eda; SnapEDA_Link: https://www.snapeda.com/parts/10067847-001RLF/Amphenol%20FCI/view-part/1746378/?ref=snap; Purchase-URL: https://pricing.snapeda.com/search/part/10067847-001RLF/?ref=eda; Package: None; Value: *
J20-J29 = Jumper 2 pin: CONN HEADER VERT 3POS 2.54MM; Mfr. Part No.: 75160-156-03LF; Value: 51R; Unit Price (USD): 0.74; Supplier Part No.: 609-75160-156-03LF-ND; Supplier: Digikey Electronics
Q1 Q3 Q5 Q7 Q9 = MOSFET-P: Supplier: Digikey Electronics
Q2 Q4 Q6 Q8 Q10 = MMBT3904: Manufacturer: Diodes Inc.; Man. PN: MMBT3904-7-F; Other: NPN. SOT23-3; Value: MMBT3904; Supplier: LCSC; Supplier PN: C94514
R14 R24-R27 R43 R53 R54 R56 R59 R61 R63 R65 R67 R75 = Res1: Resistor; Value: 10K; Published: 8-Jun-2000; LatestRevisionDate: 17-Jul-2002; LatestRevisionNote: Re-released for DXP Platform.; PackageReference: AXIAL-0.3; Publisher: Altium Limited; PackageDescription: Axial Device, Thru-Hole; 2 Leads; 0.3 in Pin Spacing
R44 R60 R62 R64 R66 = Res1: Resistor; Published: 8-Jun-2000; LatestRevisionDate: 17-Jul-2002; LatestRevisionNote: Re-released for DXP Platform.; PackageReference: AXIAL-0.3; Publisher: Altium Limited; PackageDescription: Axial Device, Thru-Hole; 2 Leads; 0.3 in Pin Spacing; Value: 10K
R70-R74 = Res1: Resistor; Value: 200K; Published: 8-Jun-2000; LatestRevisionDate: 17-Jul-2002; LatestRevisionNote: Re-released for DXP Platform.; PackageReference: AXIAL-0.3; Publisher: Altium Limited; PackageDescription: Axial Device, Thru-Hole; 2 Leads; 0.3 in Pin Spacing
U6-U10 = GL3224: MEMORY CARD READER CONTROLLER; Manufacturer: Genesys Logic Inc; Manufacturer Product Number: GL3224; Supplier: Quest Components; Unit Price: $15; Stock: 15